# EAGLE schematic 17323 (EAGLE 7.6.0)
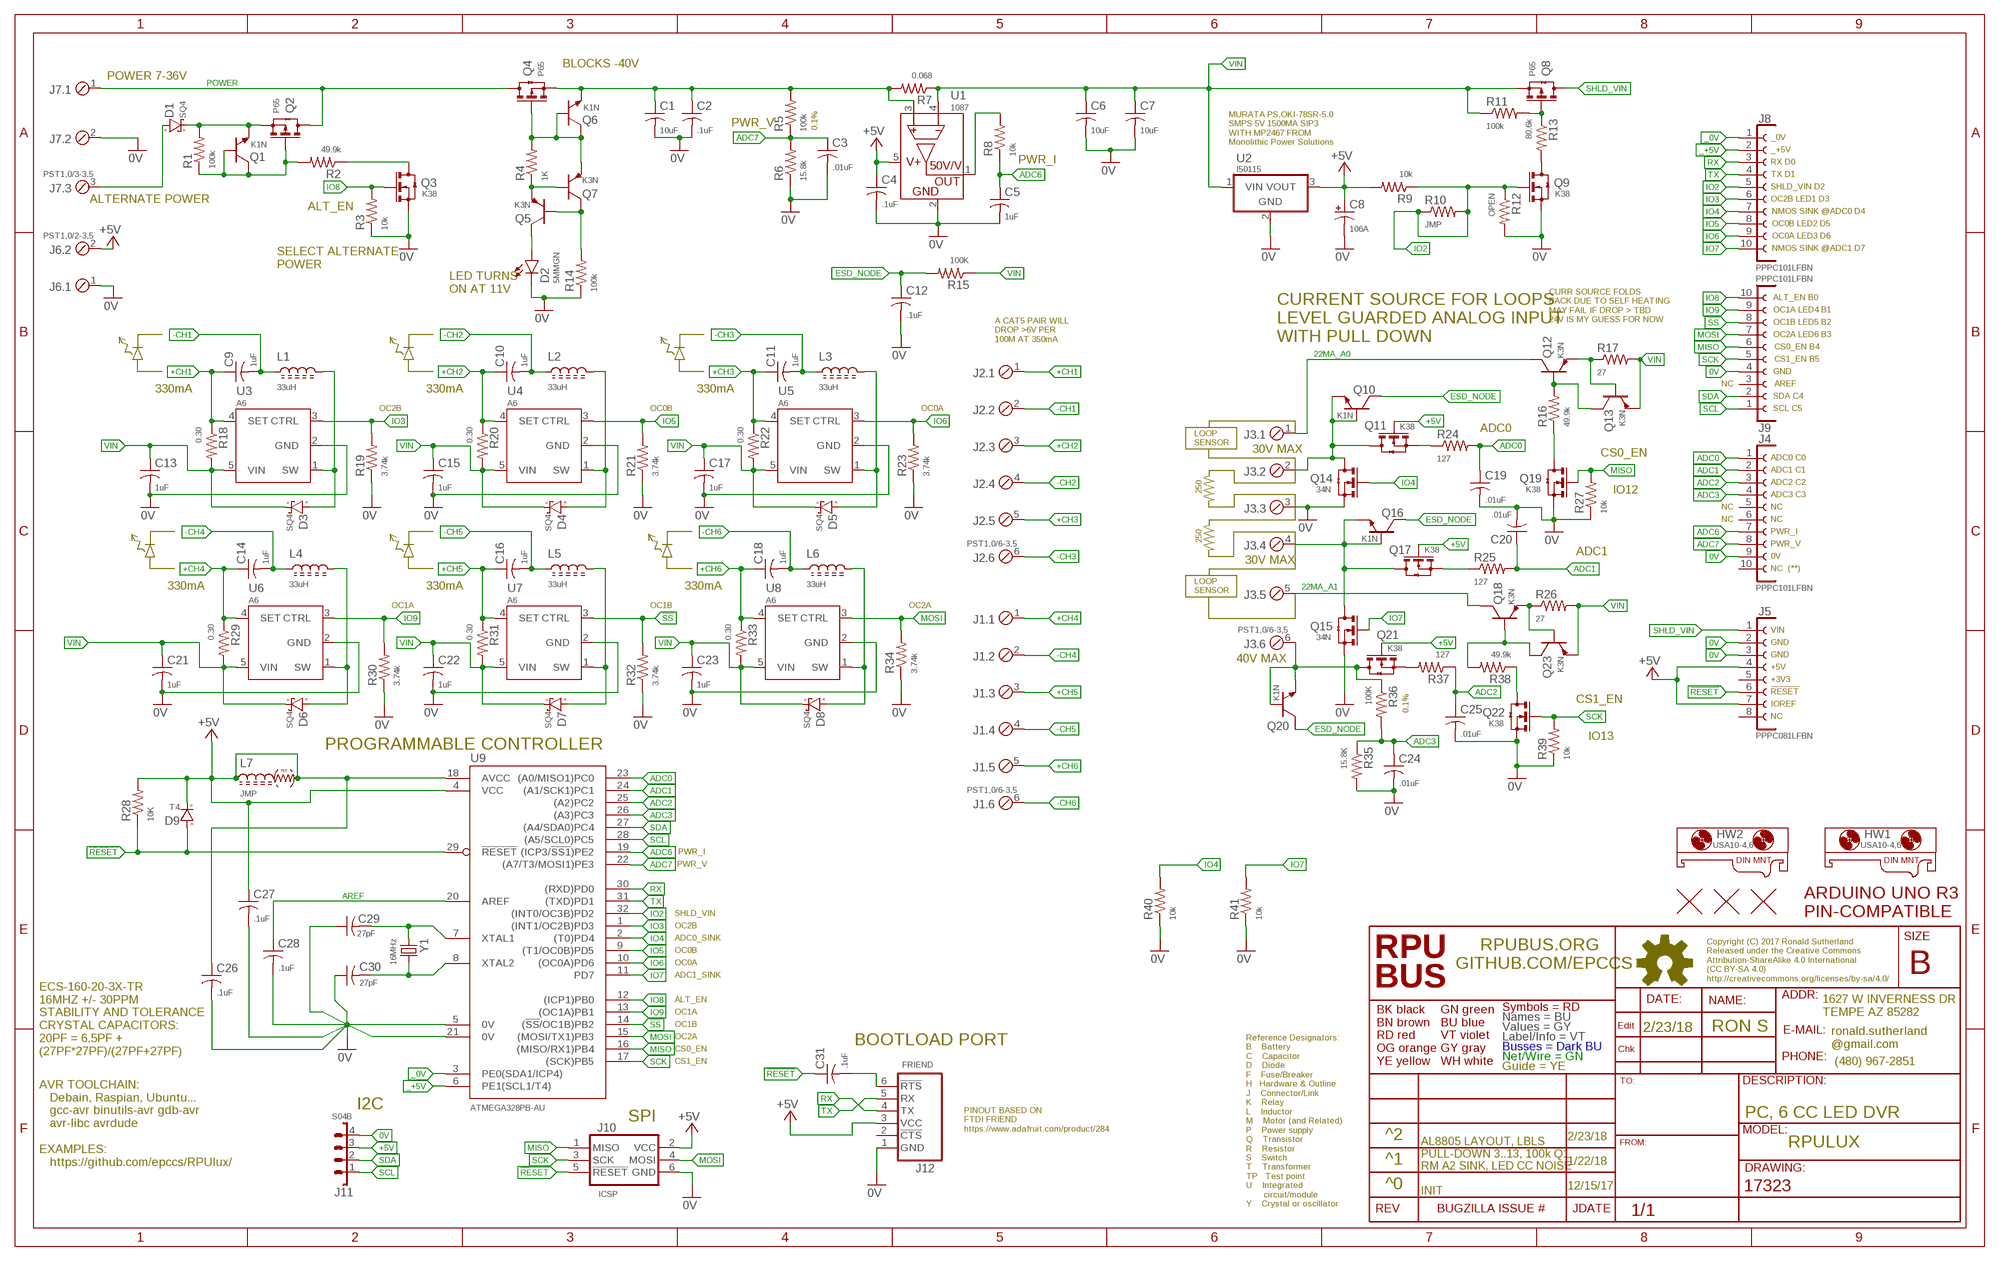
[diagram p0: schematic, sheet 1]

## Parts
C1  10uF  CC1206  [C1206(3216)]
C2  .1uF  CC0805A  [C0805(2012)]
C3  .01uF  CC0603A  [C0603(1608)]
C4  .1uF  CC0603A  [C0603(1608)]
C5  1uF  CC0805A  [C0805(2012)]
C6  10uF  CC1206  [C1206(3216)]
C7  10uF  CC1206  [C1206(3216)]
C8  106A  CT1206  [3216]
C9  1uF  CC0805A  [C0805(2012)]
C10  1uF  CC0805A  [C0805(2012)]
C11  1uF  CC0805A  [C0805(2012)]
C12  .1uF  CC0603A  [C0603(1608)]
C13  1uF  CC0805A  [C0805(2012)]
C14  1uF  CC0805A  [C0805(2012)]
C15  1uF  CC0805A  [C0805(2012)]
C16  1uF  CC0805A  [C0805(2012)]
C17  1uF  CC0805A  [C0805(2012)]
C18  1uF  CC0805A  [C0805(2012)]
C19  .01uF  CC0603A  [C0603(1608)]
C20  .01uF  CC0603A  [C0603(1608)]
C21  1uF  CC0805A  [C0805(2012)]
C22  1uF  CC0805A  [C0805(2012)]
C23  1uF  CC0805A  [C0805(2012)]
C24  .01uF  CC0603A  [C0603(1608)]
C25  .01uF  CC0603A  [C0603(1608)]
C26  .1uF  CC0603A  [C0603(1608)]
C27  .1uF  CC0603A  [C0603(1608)]
C28  .1uF  CC0603A  [C0603(1608)]
C29  27pF  CC0603A  [C0603(1608)]
C30  27pF  CC0603A  [C0603(1608)]
C31  .1uF  CC0603A  [C0603(1608)]
D1  SQ4  DSMA  [SMA]
D2  5MMGN  LED5MM  [LED5MM]
D3  SQ4  DSMA  [SMA]
D4  SQ4  DSMA  [SMA]
D5  SQ4  DSMA  [SMA]
D6  SQ4  DSMA  [SMA]
D7  SQ4  DSMA  [SMA]
D8  SQ4  DSMA  [SMA]
D9  T4  DSOD123  [SOD123]
HW1  USA10-4,6  MOUNT-HOLE5.0  [USA10]
HW2  USA10-4,6  MOUNT-HOLE5.0  [USA10]
J1  PST1,0/6-3,5  MCV6  [MCV6]
J2  PST1,0/6-3,5  MCV6  [MCV6]
J3  PST1,0/6-3,5  MCV6  [MCV6]
J4  PPPC101LFBN  F1X10  [F1X10]
J5  PPPC081LFBN  F1X8  [F1X8]
J6  PST1,0/2-3,5  MCV2  [MCV2]
J7  PST1,0/3-3,5  MCV3  [MCV3]
J8  PPPC101LFBN  F1X10  [F1X10]
J9  PPPC101LFBN  F1X10  [F1X10]
J10  ICSP  ISP-SPIPTH  [ISP]
J11  S04B  B04B  [B04B]
J12  FRIEND  [FRIEND]
L1  33uH  L2424  [L2424]
L2  33uH  L2424  [L2424]
L3  33uH  L2424  [L2424]
L4  33uH  L2424  [L2424]
L5  33uH  L2424  [L2424]
L6  33uH  L2424  [L2424]
L7  JMP  L0805  [C0805(2012)]
Q1  K1N  NPNSOT23  [SOT23]
Q2  P65  N-CHSOT23  [SOT23]
Q3  K38  N-CHSOT23  [SOT23]
Q4  P65  N-CHSOT23  [SOT23]
Q5  K3N  PNPSOT23  [SOT23]
Q6  K1N  NPNSOT23  [SOT23]
Q7  K3N  PNPSOT23  [SOT23]
Q8  P65  N-CHSOT23  [SOT23]
Q9  K38  N-CHSOT23  [SOT23]
Q10  K1N  NPNSOT23  [SOT23]
Q11  K38  N-CHSOT23  [SOT23]
Q12  K3N  PNPSOT23  [SOT23]
Q13  K3N  PNPSOT23  [SOT23]
Q14  34N  N-CHSOT23  [SOT23]
Q15  34N  N-CHSOT23  [SOT23]
Q16  K1N  NPNSOT23  [SOT23]
Q17  K38  N-CHSOT23  [SOT23]
Q18  K3N  PNPSOT23  [SOT23]
Q19  K38  N-CHSOT23  [SOT23]
Q20  K1N  NPNSOT23  [SOT23]
Q21  K38  N-CHSOT23  [SOT23]
Q22  K38  N-CHSOT23  [SOT23]
Q23  K3N  PNPSOT23  [SOT23]
R1  100k  R0805  [C0805(2012)]
R2  49.9k  R0805  [C0805(2012)]
R3  10k  R0805  [C0805(2012)]
R4  1K  R0805  [C0805(2012)]
R5  100k  R0805  [C0805(2012)]
R6  15.8k  R0805  [C0805(2012)]
R7  0.068  R1210  [C1210(3225)]
R8  10k  R0805  [C0805(2012)]
R9  10k  R0805  [C0805(2012)]
R10  JMP  R0805  [C0805(2012)]
R11  100k  R0805  [C0805(2012)]
R12  OPEN  R0805  [C0805(2012)]
R13  80.6k  R0805  [C0805(2012)]
R14  100k  R0805  [C0805(2012)]
R15  100K  R0805  [C0805(2012)]
R16  49.9k  R0805  [C0805(2012)]
R17  27  R0805  [C0805(2012)]
R18  0.30  R1210  [C1210(3225)]
R19  3.74k  R0805  [C0805(2012)]
R20  0.30  R1210  [C1210(3225)]
R21  3.74k  R0805  [C0805(2012)]
R22  0.30  R1210  [C1210(3225)]
R23  3.74k  R0805  [C0805(2012)]
R24  127  R0805  [C0805(2012)]
R25  127  R0805  [C0805(2012)]
R26  27  R0805  [C0805(2012)]
R27  10k  R0805  [C0805(2012)]
R28  10K  R0805  [C0805(2012)]
R29  0.30  R1210  [C1210(3225)]
R30  3.74k  R0805  [C0805(2012)]
R31  0.30  R1210  [C1210(3225)]
R32  3.74k  R0805  [C0805(2012)]
R33  0.30  R1210  [C1210(3225)]
R34  3.74k  R0805  [C0805(2012)]
R35  15.8K  R0805  [C0805(2012)]
R36  100K  R0805  [C0805(2012)]
R37  127  R0805  [C0805(2012)]
R38  49.9k  R0805  [C0805(2012)]
R39  10k  R0805  [C0805(2012)]
R40  10k  R0805  [C0805(2012)]
R41  10k  R0805  [C0805(2012)]
U1  1087  ZXCT1087  [SOT23-5]
U2  I50115  OKI-78SR-H  [OKI-78SR-H]
U3  A6  AL8805  [SOT23-5]
U4  A6  AL8805  [SOT23-5]
U5  A6  AL8805  [SOT23-5]
U6  A6  AL8805  [SOT23-5]
U7  A6  AL8805  [SOT23-5]
U8  A6  AL8805  [SOT23-5]
U9  ATMEGA328PB-AU  [TQFP32-08]
U$1  ARDUINO-UNO  [ARDUINO_UNO]
U$2  FIDUCIAL1.27  [FIDUCIAL-1.27]
U$3  FIDUCIAL1.27  [FIDUCIAL-1.27]
U$4  FIDUCIAL1.27  [FIDUCIAL-1.27]
Y1  16MHz  CSM-3X  [CSM-3X]

## Nets
0V: C1.2 C2.2 C3.2 C4.2 C5.2 C6.2 C7.2 C8.- C12.2 C13.2 C15.2 C17.2 C19.2 C20.2 C21.2 C22.2 C23.2 C24.2 C25.2 C26.2 C27.2 C28.2 C29.1 C30.1 D2.K J3.3 J4.9 J5.2 J5.3 J6.1 J7.2 J9.4 J10.6(GND) J11.4 J12.1(GND) Q3.2(S)(S) Q9.2(S)(S) Q14.2(S)(S) Q15.2(S)(S) Q19.2(S)(S) Q22.2(S)(S) R3.1 R6.1 R12.2 R14.1 R19.1 R21.1 R23.1 R27.1 R30.1 R32.1 R34.1 R35.2 R39.1 R40.1 R41.1 U1.2(GND) U2.2(GND) U3.2(GND) U4.2(GND) U5.2(GND) U6.2(GND) U7.2(GND) U8.2(GND) U9.5(0V) U9.21(0V)
22MA_A0: J3.1 Q12.C
22MA_A1: J3.5 Q18.C
!RESET!: C31.1 D9.A J5.6 J10.5(!RESET) R28.1 U9.29(!RESET)
!SS: J9.8 R32.2 U7.3(CTRL) U9.14((!SS!/OC1B)PB2)
+5V: C4.1 C8.+ C26.1 C27.1 D9.C(K) J5.4 J5.7 J6.2 J10.2(VCC) J11.3 J12.3(VCC) L7.1 L7.2 Q11.1(G)(G) Q17.1(G)(G) Q21.1(G)(G) R9.2 R28.2 U1.5(VCC) U2.3(VOUT) U9.4(VCC) U9.18(AVCC)
+CH1: C9.1 J2.1 R18.1 U3.4(SET)
+CH2: C10.1 J2.3 R20.1 U4.4(SET)
+CH3: C11.1 J2.5 R22.1 U5.4(SET)
+CH4: C14.1 J1.1 R29.1 U6.4(SET)
+CH5: C16.1 J1.3 R31.1 U7.4(SET)
+CH6: C18.1 J1.5 R33.1 U8.4(SET)
-CH1: C9.2 J2.2 L1.1
-CH2: C10.2 J2.4 L2.1
-CH3: C11.2 J2.6 L3.1
-CH4: C14.2 J1.2 L4.1
-CH5: C16.2 J1.4 L5.1
-CH6: C18.2 J1.6 L6.1
_0V: J8.1 U9.3(PE0(SDA1/ICP4))
_+5V: J8.2 U9.6(PE1(SCL1/T4))
ADC0: C19.1 J4.1 R24.2 U9.23((A0/MISO1)PC0)
ADC1: C20.1 J4.2 R25.2 U9.24((A1/SCK1)PC1)
ADC2: C25.1 J4.3 R37.1 U9.25((A2)PC2)
ADC3: C24.1 J4.4 R35.1 R36.2 U9.26((A3)PC3)
ADC6: C5.1 J4.7 R8.1 U9.19((ICP3/!SS1!)PE2)
ADC7: C3.1 J4.8 R5.1 R6.2 U9.22((A7/T3/MOSI1)PE3)
AREF: C28.1 U9.20(AREF)
ESD_NODE: C12.1 Q10.C Q16.C Q20.C R15.2
IO2: J8.5 Q9.1(G)(G) R9.1 R10.1 R10.2 R12.1 U9.32((INT0/OC3B)PD2)
IO3: J8.6 R19.2 U3.3(CTRL) U9.1((INT1/OC2B)PD3)
IO4: J8.7 Q14.1(G)(G) R40.2 U9.2((T0)PD4)
IO5: J8.8 R21.2 U4.3(CTRL) U9.9((T1/OC0B)PD5)
IO6: J8.9 R23.2 U5.3(CTRL) U9.10((OC0A)PD6)
IO7: J8.10 Q15.1(G)(G) R41.2 U9.11(PD7)
IO8: J9.10 Q3.1(G)(G) R3.2 U9.12((ICP1)PB0)
IO9: J9.9 R30.2 U6.3(CTRL) U9.13((OC1A)PB1)
MISO: J9.6 J10.1(MISO) Q19.1(G)(G) R27.2 U9.16((MISO/RX1)PB4)
MOSI: J9.7 J10.4(MOSI) R34.2 U8.3(CTRL) U9.15((MOSI/TX1)PB3)
N$1: Q21.2(S)(S) R37.2
N$2: Q8.1(G)(G) R11.2 R13.1
N$3: D3.A L1.2 U3.1(SW)
N$4: Q9.3(D)(D) R13.2
N$5: Q5.B Q7.C R14.2
N$6: Q4.1(G)(G) Q6.B Q6.C Q7.E R4.2
N$7: D2.A Q5.C
N$8: R8.2 U1.1(OUT)
N$9: J3.6 Q20.B Q20.E Q21.3(D)(D) R36.1
N$10: Q5.E Q7.B R4.1
N$11: D6.A L4.2 U6.1(SW)
N$12: J3.4 Q15.3(D)(D) Q16.B Q16.E Q17.3(D)(D)
N$13: Q17.2(S)(S) R25.1
N$14: Q11.2(S)(S) R24.1
N$15: J3.2 Q10.B Q10.E Q11.3(D)(D) Q14.3(D)(D)
N$16: D4.A L2.2 U4.1(SW)
N$17: D7.A L5.2 U7.1(SW)
N$18: D5.A L3.2 U5.1(SW)
N$19: Q22.3(D)(D) R38.1
N$20: Q12.E Q13.B R17.1
N$21: Q19.3(D)(D) R16.1
N$22: D8.A L6.2 U8.1(SW)
N$23: Q12.B Q13.C R16.2
N$24: D1.A J7.3
N$25: C31.2 J12.6(!RTS)
N$28: Q18.E Q23.B R26.1
N$29: Q18.B Q23.C R38.2
N$32: D1.K Q1.E Q2.2(S)(S) R1.2
N$33: Q1.B Q1.C Q2.1(G)(G) R1.1 R2.2
N$34: Q3.3(D)(D) R2.1
N$115: C29.2 U9.7(XTAL1) Y1.1
N$116: C30.2 U9.8(XTAL2) Y1.2
POWER: J7.1 Q2.3(D)(D) Q4.3(D)(D)
RX: J8.3 J12.4(TX) U9.30((RXD)PD0)
SCK: J9.5 J10.3(SCK) Q22.1(G)(G) R39.2 U9.17((SCK)PB5)
SCL: J9.1 J11.1 U9.28((A5/SCL0)PC5)
SDA: J9.2 J11.2 U9.27((A4/SDA0)PC4)
SHLD_VIN: J5.1 Q8.3(D)(D)
TX: J8.4 J12.5(RX) U9.31((TXD)PD1)
VIN: C6.1 C7.1 C13.1 C15.1 C17.1 C21.1 C22.1 C23.1 D3.K D4.K D5.K D6.K D7.K D8.K Q8.2(S)(S) Q13.E Q23.E R7.1 R11.1 R15.1 R17.2 R18.2 R20.2 R22.2 R26.2 R29.2 R31.2 R33.2 U1.4(S-) U2.1(VIN) U3.5(VIN) U4.5(VIN) U5.5(VIN) U6.5(VIN) U7.5(VIN) U8.5(VIN)
VIN_S: C1.1 C2.1 Q4.2(S)(S) Q6.E R5.2 R7.2 U1.3(S+)
Unconnected: J4.5 J4.6 J4.10 J5.5 J5.8 J9.3 J12.2(!CTS)

## Notes on the sheet
- BLOCKS -40V
- POWER 7-36V
- PWR_V
- 0.1%
- _0V
- MURATA PS,OKI-78SR-5.0
  SMPS 5V 1500MA SIP3
  WITH MP2467 FROM 
  Monolithic Power Solutions
- _+5V
- PWR_I | RX D0
- TX D1
- SHLD_VIN D2
- ALTERNATE POWER | OC2B LED1 D3
- ALT_EN
- NMOS SINK @ADC0 D4
- OC0B LED2 D5
- OC0A LED3 D6
- NMOS SINK @ADC1 D7
- SELECT ALTERNATE
  POWER
- LED TURNS 
  ON AT 11V
- ALT_EN B0
- OC1A LED4 B1
- CURR SOURCE FOLDS 
  BACK DUE TO SELF HEATING 
  MAY FAIL IF DROP > TBD 
  24V IS MY GUESS FOR NOW
- OC1B LED5 B2
- OC2A LED6 B3
- A CAT5 PAIR WILL
  DROP >6V PER 
  100M AT 350mA
- CURRENT SOURCE FOR LOOPS
  LEVEL GUARDED ANALOG INPUT 
  WITH PULL DOWN
- CS0_EN B4
- CS1_EN B5
- GND
- NC | AREF
- 330mA | 330mA | 330mA
- SDA C4
- OC2B | OC0B | OC0A | SCL C5
- ADC0
- LOOP 
  SENSOR
- 30V MAX
- CS0_EN
- ADC0 C0
- ADC1 C1
- ADC2 C2
- 250 | IO12
- ADC3 C3
- NC | NC
- NC | NC
- PWR_I
- 250
- PWR_V
- ADC1
- 0V
- 30V MAX
- NC  (**)
- 330mA | 330mA | 330mA
- LOOP 
  SENSOR
- OC1A | OC1B | OC2A
- VIN
- GND
- GND
- 40V MAX
- +5V
- +3V3
- !RESET
- CS1_EN
- IOREF
- 0.1%
- NC
- IO13
- PROGRAMMABLE CONTROLLER
- PWR_I
- PWR_V
- SHLD_VIN
- OC2B
- ADC0_SINK
- OC0B
- OC0A
- ADC1_SINK
- ALT_EN
- OC1A
- OC1B
- 2/23/18 | RON S
- OC2A
- BOOTLOAD PORT
- CS0_EN
- ECS-160-20-3X-TR
  16MHZ +/- 30PPM
  STABILITY AND TOLERANCE
  CRYSTAL CAPACITORS:
  20PF = 6.5PF +
  (27PF*27PF)/(27PF+27PF)
- CS1_EN
- I2C
- SPI | PC, 6 CC LED DVR
- PINOUT BASED ON
  FTDI FRIEND
  https://www.adafruit.com/product/284
- ^2 | 2/23/18
- AL8805 LAYOUT, LBLS | RPULUX
- ^1 | 1/22/18
- AVR TOOLCHAIN: 
     Debain, Raspian, Ubuntu...
     gcc-avr binutils-avr gdb-avr 
     avr-libc avrdude
  
  EXAMPLES:
     https://github.com/epccs/RPUlux/
- PULL-DOWN 3..13, 100k Q1
  RM A2 SINK, LED CC NOISE
- ^0 | 12/15/17
- INIT

## Library data of the parts
C1-C7 C9-C31 = C-C:C: CAPACITOR Symbol
C8 = C-T:CT: Tantalum Electrolytic Capacitor
D1 D3-D8 = D-SBR:D: DIODE
D2 = D-LED:LED: LED 120120WH [CREE,XHGAWT-00-0000-00000HXE1] LED WHITE 6500K 150LUM-W120120
D9 = D-GP:D: DIODE
HW1 HW2 = HW-DINMnt:MOUNT-HOLE: USA10-4.6 [PhxCont,1202713] DINRAIL ADAPTER UNIVERSAL 10MM 4.6MM
J1-J3 = J-HDR3.5mm:MCV6: MCV 1,5/6-G-3,5 [PHOENIX CONTACT,1843648] CONN HEADER SHROUDED 6POS 3.5MM MCVR 1,5/6-ST-3,5 [PHOENIX CONTACT,1863194] CONN PLUG 6POS SCREW 3.5MM PST 1,0/6-3,5 [PHOENIX CONTACT,1945135] CONN HEADER STRIP PIN 6POS 3.5MM PT 1,5/6-PVH-3,5 [PHOENIX CONTACT,1984057] CONN PLUG STRIP 6POS 3.5MM Drill Size 3/64": .0469" (1.2mm)
J4 J8 J9 = J-HDR2.54mm:F1X10: FEMALE HEADER 10POS
J5 = J-HDR2.54mm:F1X8: FEMALE HEADER 8POS
J6 = J-HDR3.5mm:MCV2: MCV 1,5/ 2-G-3,5-RN [PHOENIX CONTACT,1731471] CONN HEADER SHROUDED 2POS 3.5MM MCVR 1,5/ 2-ST-3,5 [PHOENIX CONTACT,1863152] CONN PLUG 2POS SCREW 3.5MM PST 1,0/2-3,5 [PHOENIX CONTACT,1945096] CONN HEADER STRIP PIN 2POS 3.5MM PT1,5/2-PVH-3,5 [PHOENIX CONTACT,1984015] CONN PLUG STRIP 2POS 3.5MM
J7 = J-HDR3.5mm:MCV3: MCV 1,5/ 3-G-3,5-RN [PHOENIX CONTACT,1731484] CONN HEADER SHROUDED 3POS 3.5MM MCVR 1,5/ 3-ST-3,5 [PHOENIX CONTACT,1863165] CONN PLUG 3POS SCREW 3.5MM PST 1,0/3-3,5 [PHOENIX CONTACT,1945106] CONN HEADER STRIP PIN 3POS 3.5MM PT1,5&3-PVH-3,5 [PHOENIX CONTACT,1984028] CONN PLUG STRIP 3POS 3.5MM
J10 = U-AVR:ISP-SPI: AVR ISP thru SPI In-System Programming uses the target Atmel AVR’s internal SPI (Serial Peripheral Interface) to download code into the flash and EEPROM memories. It is not a debugging interface. When designing an application PCB which includes an AVR with the SPI interface, this pinout should be used. Sparkfun SKU: BOB-08508
J11 = J-HDR2mm:B04B: B04B [JST@B04B-PASK] CONN HEADER VERT THRU 4POS S04B [JST@S04B-PASK] CONN HEADER SIDE THRU 4POS
J12 = U-AVR:FRIEND: used for serial interfaces and serial bootloaders optiboot does not read the fuse but reports as they should be. It also erases chip. avrdude -c arduino -v -p atmega328p -P /dev/ttyUSB0 -b 115200 -U flash:w:BlinkLED.hex xboot use -e to erase chip, and -u to disable fuse checks since bootloaders can't see them. avrdude -c avr109 -v -p atmega1284p -P /dev/ttyUSB0 -b 115200 -e -u -U flash:w:BlinkLED.hex Arduino uses the nRTS (or nDTR) negative going edge to start the bootloader by causing a reset on the MCU.
L1-L6 = L-PWR:L: Inductor
L7 = L-FB:L: Ferrite Bead with frequency dependent resistance
Q1 Q6 Q10 Q16 Q20 = Q-NPN:NPN: BJT NPN General Purpose Amplifier
Q2 Q4 Q8 = Q-PCH:N-CH?*: ENHANCEMENT MODE MOSFET SOT23 is BSS138 pinout
Q3 Q9 Q11 Q14 Q15 Q17 Q19 Q21 Q22 = Q-NCH:N-CH?*: ENHANCEMENT MODE MOSFET SOT23 is BSS138 pinout
Q5 Q7 Q12 Q13 Q18 Q23 = Q-PNP:PNP: BJT NPN General Purpose Amplifier
R1-R41 = R-C:R: Resiistor American-style symbol
U1 = U-Linear:ZXCT1087: 1087 [DIODES,ZXCT1087E5TA] HISIDE CURRENT MONITOR SOT23-5
U2 = P-DCDC:OKI-78SR: OKI-78SR OKI-78SR-5/1.5-W36H-C 5V@1.5A Horizontal Mount OKI-78SR-5/1.5-W36-C 5V@1.5A Vert Mount OKI-78SR-3.3/1.5-W36H-C 3.3V@1.5A Horizontal Mount OKI-78SR-3.3/1.5-W36-C 3.3V@1.5A Vert Mount Murata Power Solutions 7 to 36 VDC input range need to verify pinout
U3-U8 = U-Linear:AL8805: A6 [DIODES,AL8805W5-7] CURR DRIVER SOT23-5
U9 = U-AVR:ATMEGA328PB-AU: ATmega328PB 4 Kbytes FLASH 128 bytes SRAM 256 bytes EEPROM 2 UART, 2 I2C, 2 SPI 8-channel 10 bit ADC
U$1 = J-BoardHDR:ARDUINO-UNO: Board Outline with holes and silk note the board dim layer is not defined
U$2-U$4 = H-Fiducial:FIDUCIAL: Fiducial Alignment Points Various fiducial points for machine vision alignment.
Y1 = Y-XTL:CSM: 16MHZ20 [ECS,ECS-160-20-3X-TR] CRYSTAL 16MHZ 20PF 30PPM CSM-3X

## Net classes
0 default: width 0.178 mm, drill 0.33 mm